# EAGLE schematic main (EAGLE 9.6.2)
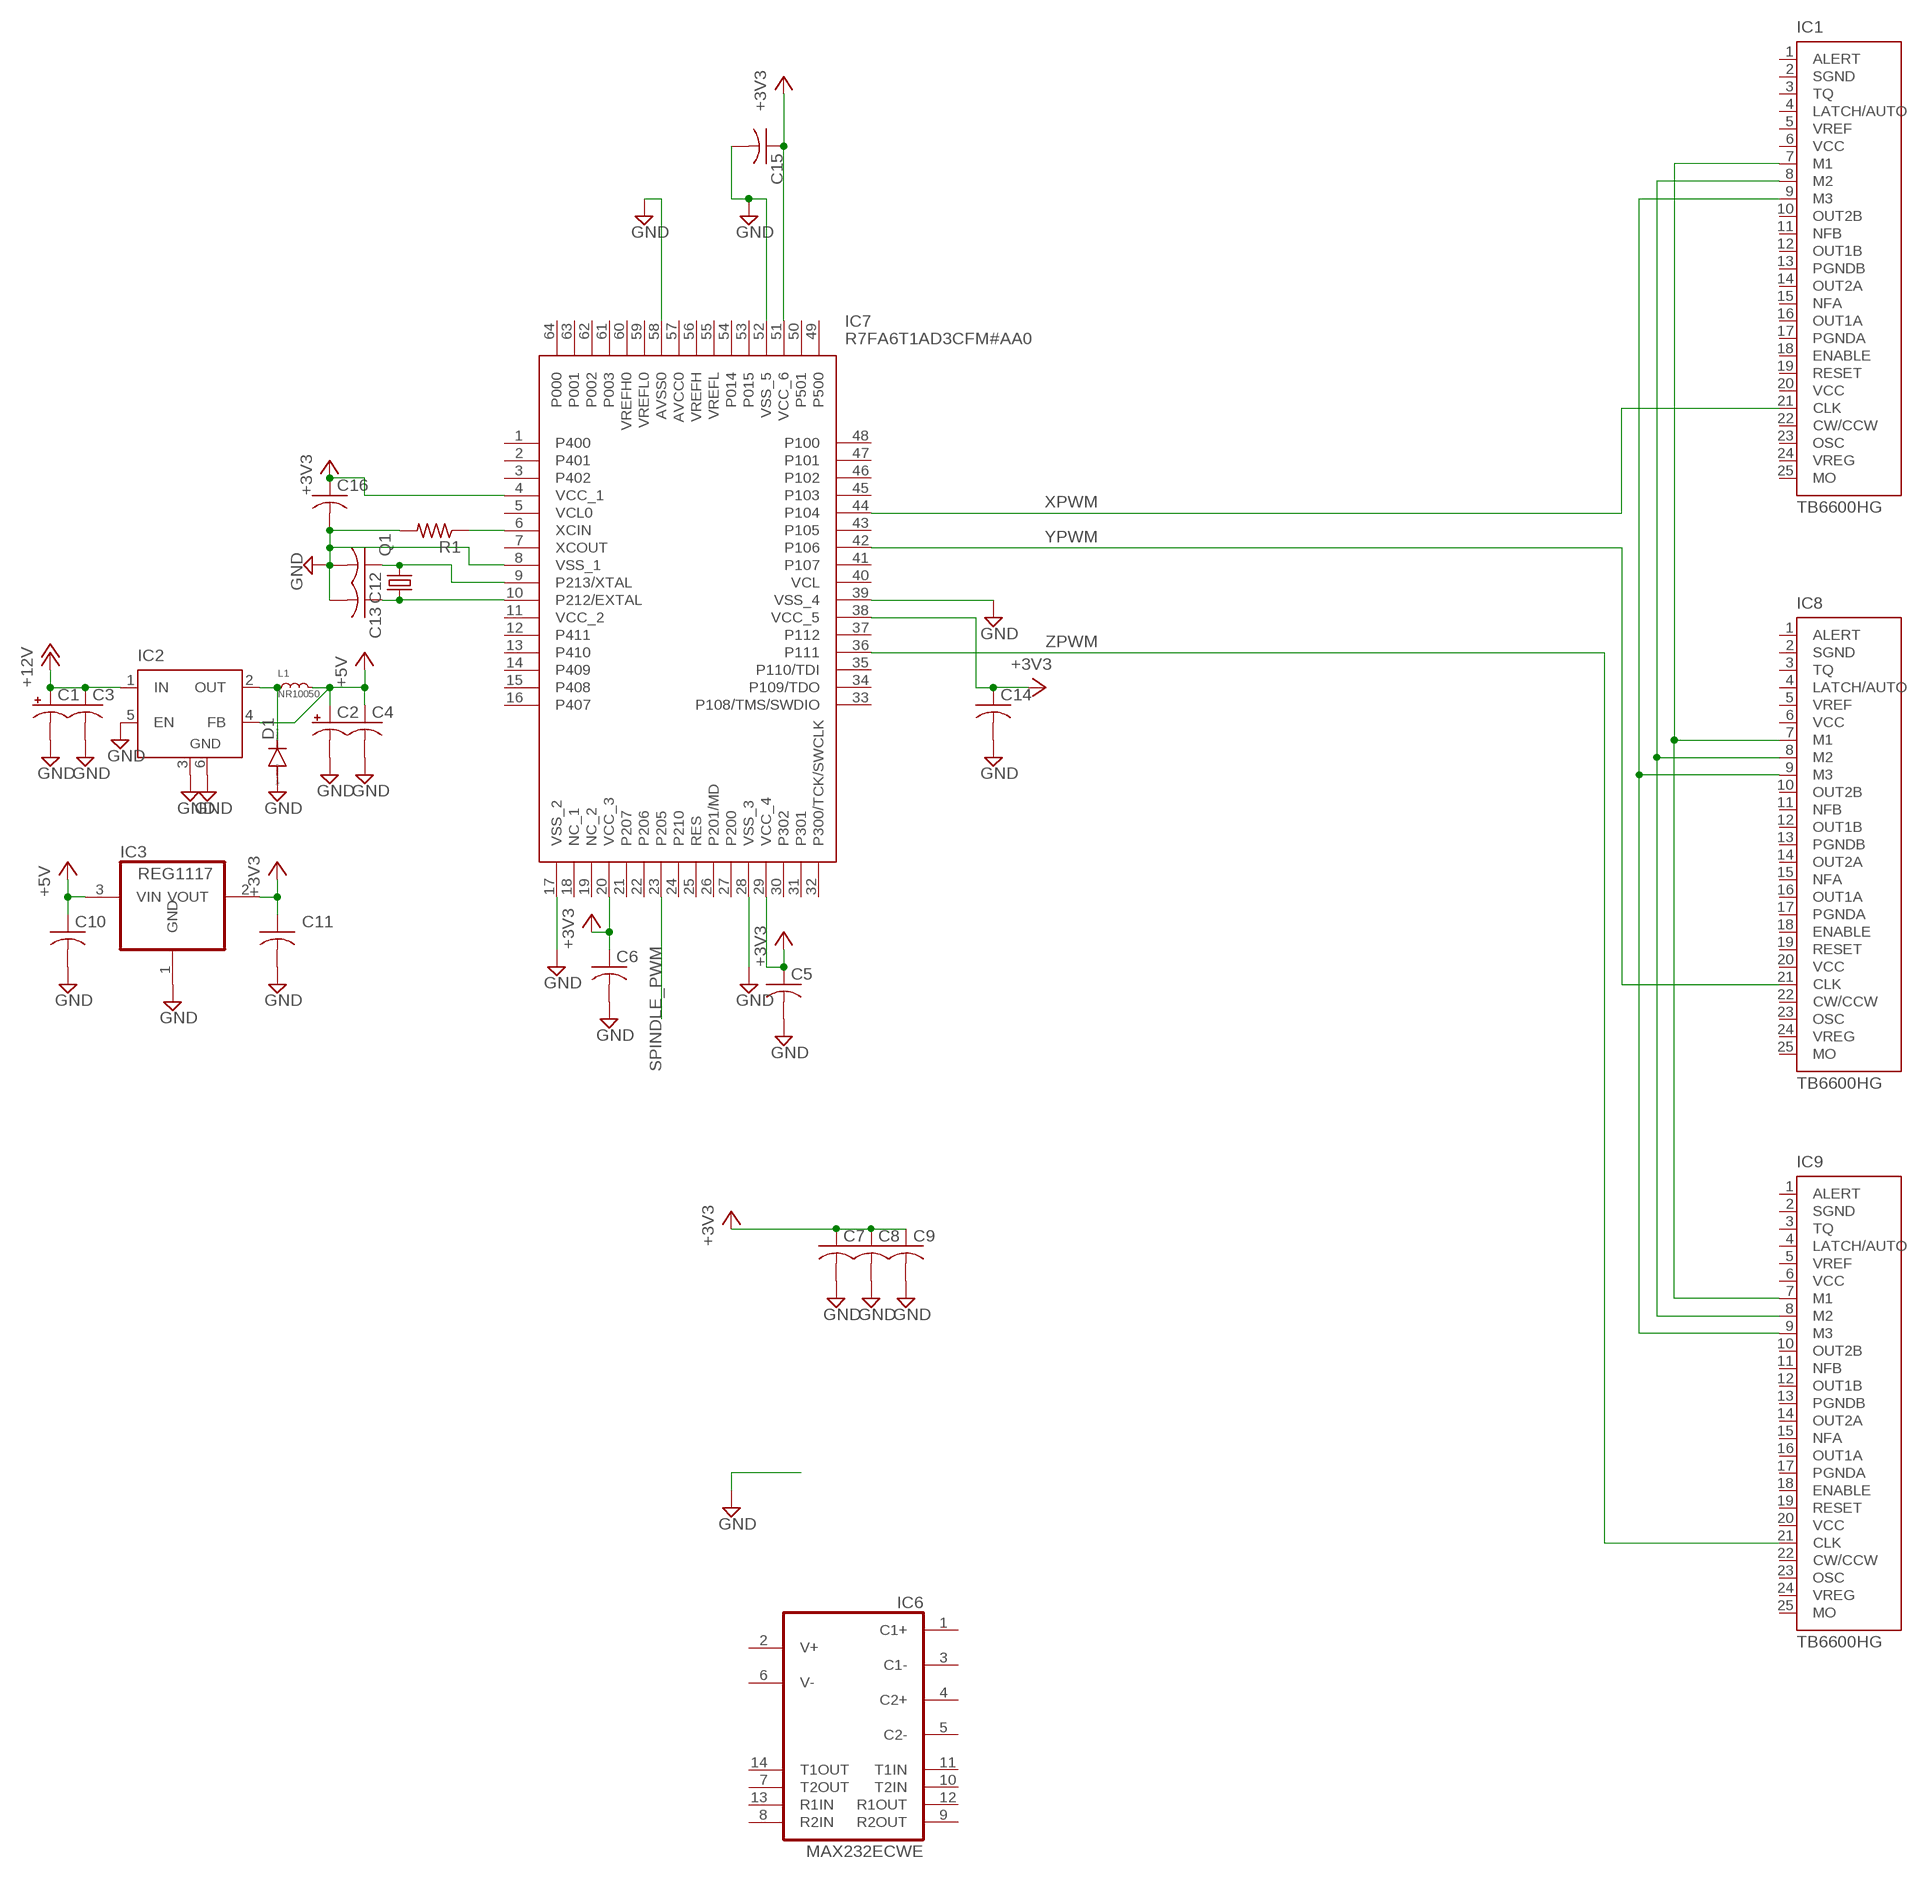
[diagram p0: schematic, sheet 1]

## Parts
C1  CPOL-USUD-6,3X5,8  [UD-6,3X5,8_NICHICON]
C2  CPOL-USUD-6,3X5,8  [UD-6,3X5,8_NICHICON]
C3  C-USC0805K  [C0805K]
C4  C-USC0805K  [C0805K]
C5  C-USC0603K  [C0603K]
C6  C-USC0603K  [C0603K]
C7  C-USC0603K  [C0603K]
C8  C-USC0603K  [C0603K]
C9  C-USC0603K  [C0603K]
C10  C-USC1206K  [C1206K]
C11  C-USC1206K  [C1206K]
C12  C-USC0603K  [C0603K]
C13  C-USC0603K  [C0603K]
C14  C-USC0603K  [C0603K]
C15  C-USC0603K  [C0603K]
C16  C-USC0603K  [C0603K]
D1  DIODE-SOD123  [SOD123]
IC1  TB6600HG  [HZIP25-P-1.00F]
IC2  LM2596S  [TO263-5]
IC3  REG1117  [SOT223]
IC6  MAX232ECWE  [SO16L]
IC7  R7FA6T1AD3CFM#AA0  [QFP50P1200X1200X170-64N]
IC8  TB6600HG  [HZIP25-P-1.00F]
IC9  TB6600HG  [HZIP25-P-1.00F]
L1  NR10050  [NR10050]
Q1  KX-7  [3.2X2.5_KX-7]
R1  R-US_R0805  [R0805]

## Nets
+3V3: C5.1 C6.1 C7.1 C8.1 C9.1 C11.1 C14.1 C15.1 C16.1 IC3.2(VOUT) IC7.4(VCC_1) IC7.20(VCC_3) IC7.29(VCC_4) IC7.38(VCC_5) IC7.51(VCC_6)
+5V: C2.+ C4.1 C10.1 IC2.4(FB) IC3.3(VIN) L1.P$2
+12V: C1.+ C3.1 IC2.1(IN)
GND: C1.- C2.- C3.2 C4.2 C5.2 C6.2 C7.2 C8.2 C9.2 C10.2 C11.2 C12.2 C13.2 C14.2 C15.2 C16.2 D1.A IC2.3(GND) IC2.5(EN) IC2.6(GND) IC3.1(GND) IC7.8(VSS_1) IC7.17(VSS_2) IC7.28(VSS_3) IC7.39(VSS_4) IC7.52(VSS_5) IC7.58(AVSS0) R1.2
N$2: D1.C IC2.2(OUT) L1.P$1
N$3: IC7.6(XCIN) R1.1
N$5: C12.1 IC7.9(P213/XTAL) Q1.3
N$6: C13.1 IC7.10(P212/EXTAL) Q1.1
N$9: IC1.7(M1) IC8.7(M1) IC9.7(M1)
N$10: IC1.8(M2) IC8.8(M2) IC9.8(M2)
N$11: IC1.9(M3) IC8.9(M3) IC9.9(M3)
SPINDLE_PWM: IC7.23(P205)
XPWM: IC1.21(CLK) IC7.44(P104)
YPWM: IC7.42(P106) IC8.21(CLK)
ZPWM: IC7.36(P111) IC9.21(CLK)
Unconnected: IC1.1(ALERT) IC1.3(TQ) IC1.4(LATCH/AUTO) IC1.5(VREF) IC1.10(OUT2B) IC1.11(NFB) IC1.12(OUT1B) IC1.14(OUT2A) IC1.15(NFA) IC1.16(OUT1A) IC1.18(ENABLE) IC1.19(RESET) IC1.20(VCC) IC1.22(CW/CCW) IC1.23(OSC) IC1.24(VREG) IC1.25(MO) IC6.1(C1+) IC6.2(V+) IC6.3(C1-) IC6.4(C2+) IC6.5(C2-) IC6.6(V-) IC6.7(T2OUT) IC6.8(R2IN) IC6.9(R2OUT) IC6.10(T2IN) IC6.11(T1IN) IC6.12(R1OUT) IC6.13(R1IN) IC6.14(T1OUT) IC7.1(P400) IC7.2(P401) IC7.3(P402) IC7.5(VCL0) IC7.7(XCOUT) IC7.11(VCC_2) IC7.12(P411) IC7.13(P410) IC7.14(P409) IC7.15(P408) IC7.16(P407) IC7.18(NC_1) IC7.19(NC_2) IC7.21(P207) IC7.22(P206) IC7.24(P210) IC7.25(RES) IC7.26(P201/MD) IC7.27(P200) IC7.30(P302) IC7.31(P301) IC7.32(P300/TCK/SWCLK) IC7.33(P108/TMS/SWDIO) IC7.34(P109/TDO) IC7.35(P110/TDI) IC7.37(P112) IC7.40(VCL) IC7.41(P107) IC7.43(P105) IC7.45(P103) IC7.46(P102) IC7.47(P101) IC7.48(P100) IC7.49(P500) IC7.50(P501) IC7.53(P015) IC7.54(P014) IC7.55(VREFL) IC7.56(VREFH) IC7.57(AVCC0) IC7.59(VREFL0) IC7.60(VREFH0) IC7.61(P003) IC7.62(P002) IC7.63(P001) IC7.64(P000) IC8.1(ALERT) IC8.3(TQ) IC8.4(LATCH/AUTO) IC8.5(VREF) IC8.10(OUT2B) IC8.11(NFB) IC8.12(OUT1B) IC8.14(OUT2A) IC8.15(NFA) IC8.16(OUT1A) IC8.18(ENABLE) IC8.19(RESET) IC8.20(VCC) IC8.22(CW/CCW) IC8.23(OSC) IC8.24(VREG) IC8.25(MO) IC9.1(ALERT) IC9.3(TQ) IC9.4(LATCH/AUTO) IC9.5(VREF) IC9.10(OUT2B) IC9.11(NFB) IC9.12(OUT1B) IC9.14(OUT2A) IC9.15(NFA) IC9.16(OUT1A) IC9.18(ENABLE) IC9.19(RESET) IC9.20(VCC) IC9.22(CW/CCW) IC9.23(OSC) IC9.24(VREG) IC9.25(MO)

## Power pins joined to a net without a drawn wire
GND: IC6.15(GND)
PGNDA: IC1.17(PGNDA) IC8.17(PGNDA) IC9.17(PGNDA)
PGNDB: IC1.13(PGNDB) IC8.13(PGNDB) IC9.13(PGNDB)
SGND: IC1.2(SGND) IC8.2(SGND) IC9.2(SGND)
VCC: IC1.6(VCC) IC6.16(VCC) IC8.6(VCC) IC9.6(VCC)

## Library data of the parts
C1 C2 = rcl:CPOL-US: POLARIZED CAPACITOR, American symbol; SPICEPREFIX: C
C3-C16 = rcl:C-US: CAPACITOR, American symbol; SPICEPREFIX: C
D1 = diode:DIODE-: DIODE
IC1 IC8 IC9 = toshiba:TB6600HG: PWM Chopper-Type bipolar Stepping Motor Driver IC Auto generated by make-symbol-device-package-bsdl.ulp Rev. 43 Source: TB6600HG.pdf
IC2 = linear:LM2596S: STEP-DOWN VOLTAGE REGULATOR
IC3 = burr-brown:REG1117: 800mA and 1A Low Dropout (LDO) Positive Regulator 1.8V, 2.5V, 2.85V, 3.3V, 5V, and Adj; MPN: REG1117; OC_FARNELL: 1097566; OC_NEWARK: 14P6981
IC6 = maxim:MAX232ECWE: RS232 TRANSCEIVER; MF: MAXIM; MPN: MAX232ECWE+; OC_FARNELL: 9724435; OC_NEWARK: 67K4440
IC7 = renesas:R7FA6T1AD3CFM#AA0: Renesas Electronics R7FA6T1AD3CFM#AA0, 32bit Microcontroller MCU, RA, 120MHz, 512 KB Flash, 64-Pin QFP 64 Source: Datasheet; DESCRIPTION: Renesas Electronics R7FA6T1AD3CFM#AA0, 32bit Microcontroller MCU, RA, 120MHz, 512 KB Flash, 64-Pin QFP 64; HEIGHT: 1.7mm; MANUFACTURER_NAME: Renesas Electronics; MANUFACTURER_PART_NUMBER: R7FA6T1AD3CFM#AA0; MOUSER_PART_NUMBER: 968-R7FA6T1AD3CFMAA0; MOUSER_PRICE-STOCK: https://www.mouser.co.uk/ProductDetail/Renesas-Electronics/R7FA6T1AD3CFMAA0?qs=DPoM0jnrROUVggIB2N9SYw%3D%3D
L1 = tdk:NR10050
Q1 = crystal-geyer_V1_0:KX: Quartz Crystals (MHz) SMD: KX - Serie Model Size l/w/h [mm] Frequency Range Frequency Stability Temp. Range [°C] Load Capacitance AECQ 200 availabel Datasheet KX-4 KX-5 KX-6 KX-7 KX-9A KX-9B KX-12A KX-12B KX-13 KX-20 KX-K KX-KS 1.6/1.2/0.3 2.0/1.6/0.45 2.5/2.0/0.55 3.2/2.5/0.8 5.0/3.2/1.0 5.0/3.2/1.1 6.0/3.5/1.1 6.0/3.5/1.0 7.0/5.0 /1.3 11.6/5.5/1.6 12.3/4.5/4.2 12.3/4.5/3.2 24.0 ~ 80.0 MHz 16.0 ~ 80.0 MHz 12.0 ~ 80.0 MHz 8.0 ~ 60.0 MHz 7,68 ~ 300,0 MHz 8,0 ~ 50,0 MHz 8,0 ~ 150,0 MHz 8,0 ~ 50,0 MHz 6,0 ~ 160,0 MHz 3,579 ~ 25,0 MHz 3,579 ~ 70,0 MHz 3,579 ~ 70,0 MHz ±10 … ±50ppm ±10 … ±50ppm ±10 … ±50ppm ±10 … ±50ppm ±10 … ±50ppm ±10 … ±50ppm ±10 … ±50ppm ±10 … ±50ppm ±10 … ±50ppm ±50ppm ±10 … ±50ppm ±10 … ±50ppm (*) -40°C …+85°C (*) -40°C …+125°C (*) -40°C …+125°C (*) -40°C …+125°C (*) -40°C …+105°C (*) -40°C …+105°C (*) -40°C …+125°C (*) -40°C …+105°C (*) -40°C …+105°C (*) -40°C …+105°C (*) -40°C …+85°C (*) -40°C …+85°C 8, 8…16 8, 8…16 10, 8…16 12, 7…20 16, 10…20 16, 10…20 16, 10…20 16, 12…20 16, 12…20 16, 12…20 16, 12…30 16, 12…30 - yes yes yes - - - - - - - - KX-4.pdf <http://www.geyer-electronic.de/uploads/tx_userartikelfrequenz/GEYER-KX-4.pdf> KX-5.pdf <http://www.geyer-electronic.de/uploads/tx_userartikelfrequenz/GEYER-KX-5.pdf> KX-6.pdf <http://www.geyer-electronic.de/uploads/tx_userartikelfrequenz/GEYER-KX-6.pdf> KX-7.pdf <http://www.geyer-electronic.de/uploads/tx_userartikelfrequenz/GEYER-KX-7.pdf> KX-9A.pdf <http://www.geyer-electronic.de/uploads/tx_userartikelfrequenz/GEYER-KX-9A.pdf> KX-9B.pdf <http://www.geyer-electronic.de/uploads/tx_userartikelfrequenz/GEYER-KX-9B.pdf> KX-12A.pdf <http://www.geyer-electronic.de/uploads/tx_userartikelfrequenz/GEYER-KX-12A.pdf> KX-12B.pdf <http://www.geyer-electronic.de/uploads/tx_userartikelfrequenz/GEYER-KX-12B.pdf> KX-13.pdf <http://www.geyer-electronic.de/uploads/tx_userartikelfrequenz/GEYER-KX-13.pdf> KX-20.pdf <http://www.geyer-electronic.de/uploads/tx_userartikelfrequenz/GEYER-KX-20.pdf> KX-K.pdf <http://www.geyer-electronic.de/uploads/tx_userartikelfrequenz/GEYER-KX-K.pdf> KX-KS.pdf <http://www.geyer-electronic.de/uploads/tx_userartikelfrequenz/GEYER-KX-KS.pdf> <http://www.geyer-electronic.de/fileadmin/template/img/logo-geyer-electronic.png> Details see: http://www.geyer-electronic.de/Frequenz-Produkte.9.0.html Created 2016-06-07, Hans Locher 2016 (C) Geyer Quartz Technology KX4,KX5,KX6,KX7,KX9A,KX9B,KX12A,KX12B,KX13,KX20,KXK,KXKS;1612;2016;2520;3225;5032;6035;7050;11655;12345;1,6x1,2;2,0x1,6;2,5x2,0;3,2x2,5;5,0x3,2;6,0x3,5;7,0x5,0;11,6x5,5;12,3x4,5;12,3x4,5;1.6x1.2;2.0x1.6;2.5x2.0;3.2x2.5;5.0x3.2;6.0x3.5;7.0x5.0;11.6x5.5;12.3x4.5;12.3x4.5;
R1 = rcl:R-US_: RESISTOR, American symbol; SPICEPREFIX: R